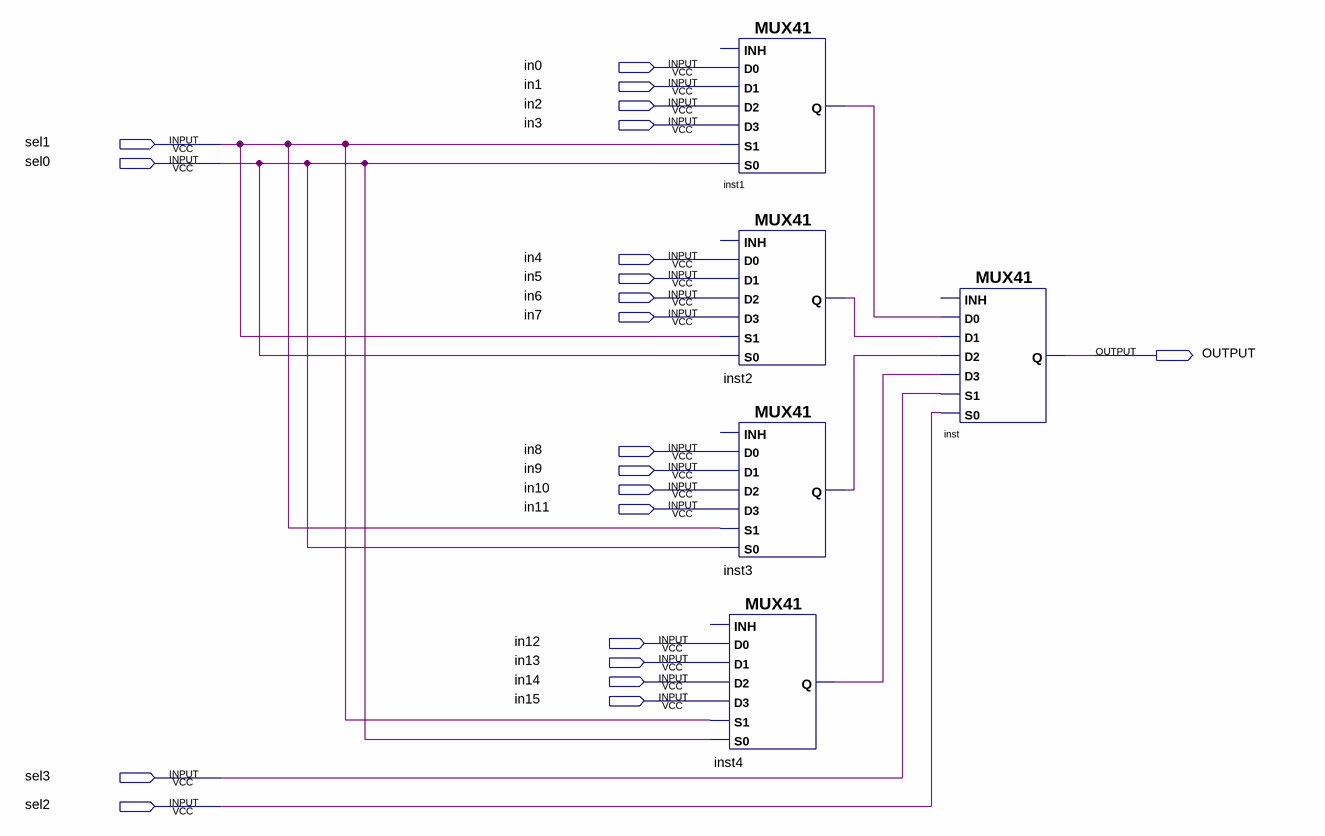
[diagram p0: schematic sheet]
// Quartus schematic muxxxx.bdf as structural Verilog: 5 symbols, 21 pins
module muxxxx (
  input  in0,
  input  in1,
  input  in2,
  input  in3,
  input  sel1,
  input  sel0,
  input  in4,
  input  in5,
  input  in6,
  input  in7,
  input  in8,
  input  in9,
  input  in10,
  input  in11,
  input  in12,
  input  in13,
  input  in14,
  input  in15,
  input  sel3,
  input  sel2,
  output OUTPUT
);

  wire inst1_q, inst2_q, inst3_q, inst4_q;

  MUX41 inst1 (.S0(sel0), .D2(in2), .S1(sel1), .D3(in3), .D0(in0), .D1(in1), .Q(inst1_q));  // open: INH
  MUX41 inst2 (.S0(sel0), .D2(in6), .S1(sel1), .D3(in7), .D0(in4), .D1(in5), .Q(inst2_q));  // open: INH
  MUX41 inst3 (.S0(sel0), .D2(in10), .S1(sel1), .D3(in11), .D0(in8), .D1(in9), .Q(inst3_q));  // open: INH
  MUX41 inst4 (.S0(sel0), .D2(in14), .S1(sel1), .D3(in15), .D0(in12), .D1(in13), .Q(inst4_q));  // open: INH
  MUX41 inst (.S0(sel2), .D2(inst3_q), .S1(sel3), .D3(inst4_q), .D0(inst1_q), .D1(inst2_q), .Q(OUTPUT));  // open: INH
endmodule
